# Altium schematic sheet AATB-V2.1.SchDoc
size A4; PageSetup: Record=PageOptions|CenterHorizontal=True|CenterVertical=True|PrintScale=1.00|XCorrection=1.00|YCorrection=1.00|PrintKind=0|BorderSize=5000000|LeftOffset=0|BottomOffset=0|Orientation=2|PaperLength=1000|PaperWidth=1000|Scale=100|PaperSource=15|PrintQuality=600|MediaType=1|DitherType=10|PaperKind=A3|PrintScaleMode=0
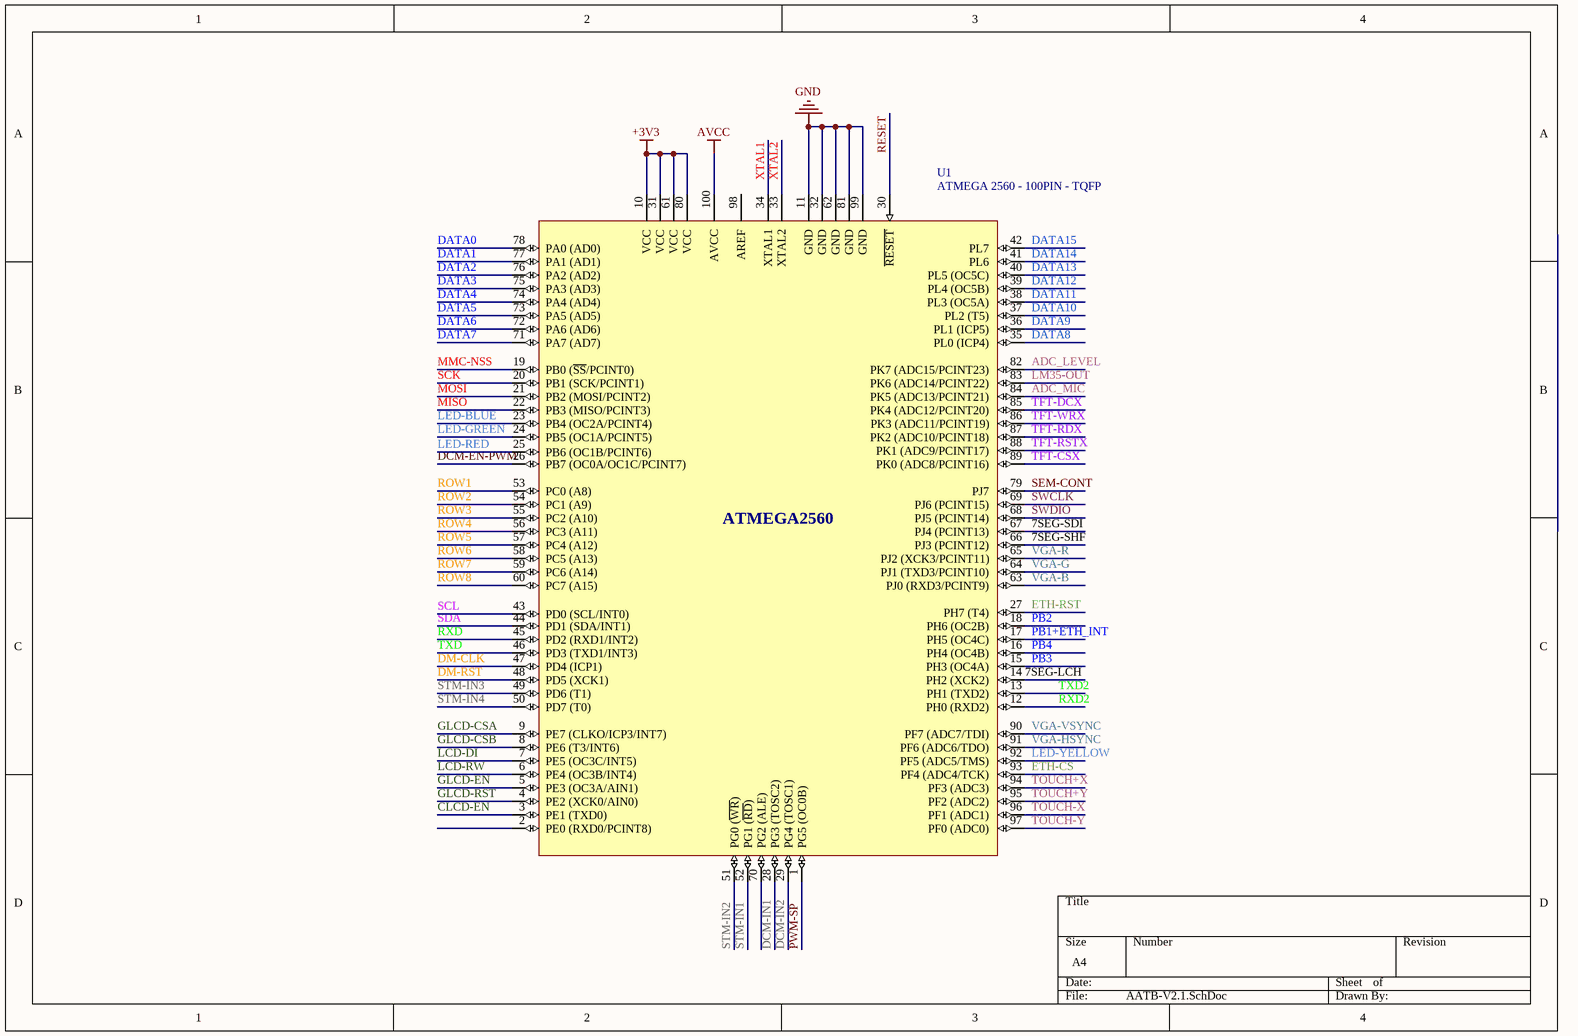
[diagram p0: AATB-V2.1.SchDoc]

## Parts
U1  ATMEGA 2560 - 100PIN - TQFP  [cpu-100-26]

## Nets
+3V3: U1.10(VCC) U1.31(VCC) U1.61(VCC) U1.80(VCC)
AVCC: U1.100(AVCC)
GND: U1.11(GND) U1.32(GND) U1.62(GND) U1.81(GND) U1.99(GND)
7SEG-LCH: U1.14(PH2_(XCK2))
7SEG-SDI: U1.67(PJ4_(PCINT13))
7SEG-SHF: U1.66(PJ3_(PCINT12))
ADC_LEVEL: U1.82(PK7_(ADC15/PCINT23))
ADC_MIC: U1.84(PK5_(ADC13/PCINT21))
CLCD-EN: U1.3(PE1_(TXD0))
DATA0: U1.78(PA0_(AD0))
DATA1: U1.77(PA1_(AD1))
DATA2: U1.76(PA2_(AD2))
DATA3: U1.75(PA3_(AD3))
DATA4: U1.74(PA4_(AD4))
DATA5: U1.73(PA5_(AD5))
DATA6: U1.72(PA6_(AD6))
DATA7: U1.71(PA7_(AD7))
DATA8: U1.35(PL0_(ICP4))
DATA9: U1.36(PL1_(ICP5))
DATA10: U1.37(PL2_(T5))
DATA11: U1.38(PL3_(OC5A))
DATA12: U1.39(PL4_(OC5B))
DATA13: U1.40(PL5_(OC5C))
DATA14: U1.41(PL6)
DATA15: U1.42(PL7)
DCM-EN-PWM: U1.26(PB7_(OC0A/OC1C/PCINT7))
DCM-IN1: U1.28(PG3_(TOSC2))
DCM-IN2: U1.29(PG4_(TOSC1))
DM-CLK: U1.47(PD4_(ICP1))
DM-RST: U1.48(PD5_(XCK1))
ETH-CS: U1.93(PF4_(ADC4/TCK))
ETH-RST: U1.27(PH7_(T4))
GLCD-CSA: U1.9(PE7_(CLKO/ICP3/INT7))
GLCD-CSB: U1.8(PE6_(T3/INT6))
GLCD-EN: U1.5(PE3_(OC3A/AIN1))
GLCD-RST: U1.4(PE2_(XCK0/AIN0))
LCD-DI: U1.7(PE5_(OC3C/INT5))
LCD-RW: U1.6(PE4_(OC3B/INT4))
LED-BLUE: U1.23(PB4_(OC2A/PCINT4))
LED-GREEN: U1.24(PB5_(OC1A/PCINT5))
LED-RED: U1.25(PB6_(OC1B/PCINT6))
LED-YELLOW: U1.92(PF5_(ADC5/TMS))
LM35-OUT: U1.83(PK6_(ADC14/PCINT22))
MISO: U1.22(PB3_(MISO/PCINT3))
MMC-NSS: U1.19(PB0_(~{SS}/PCINT0))
MOSI: U1.21(PB2_(MOSI/PCINT2))
PB1+ETH_INT: U1.17(PH5_(OC4C))
PB2: U1.18(PH6_(OC2B))
PB3: U1.15(PH3_(OC4A))
PB4: U1.16(PH4_(OC4B))
PWM-SP: U1.1(PG5_(OC0B))
RESET: U1.30(~{RESET})
ROW1: U1.53(PC0_(A8))
ROW2: U1.54(PC1_(A9))
ROW3: U1.55(PC2_(A10))
ROW4: U1.56(PC3_(A11))
ROW5: U1.57(PC4_(A12))
ROW6: U1.58(PC5_(A13))
ROW7: U1.59(PC6_(A14))
ROW8: U1.60(PC7_(A15))
RXD: U1.45(PD2_(RXD1/INT2))
RXD2: U1.12(PH0_(RXD2))
SCK: U1.20(PB1_(SCK/PCINT1))
SCL: U1.43(PD0_(SCL/INT0))
SDA: U1.44(PD1_(SDA/INT1))
SEM-CONT: U1.79(PJ7)
STM-IN1: U1.52(PG1_(~{RD}))
STM-IN2: U1.51(PG0_(~{WR}))
STM-IN3: U1.49(PD6_(T1))
STM-IN4: U1.50(PD7_(T0))
SWCLK: U1.69(PJ6_(PCINT15))
SWDIO: U1.68(PJ5_(PCINT14))
TFT-CSX: U1.89(PK0_(ADC8/PCINT16))
TFT-DCX: U1.85(PK4_(ADC12/PCINT20))
TFT-RDX: U1.87(PK2_(ADC10/PCINT18))
TFT-RSTX: U1.88(PK1_(ADC9/PCINT17))
TFT-WRX: U1.86(PK3_(ADC11/PCINT19))
TOUCH+X: U1.94(PF3_(ADC3))
TOUCH+Y: U1.95(PF2_(ADC2))
TOUCH-X: U1.96(PF1_(ADC1))
TOUCH-Y: U1.97(PF0_(ADC0))
TXD: U1.46(PD3_(TXD1/INT3))
TXD2: U1.13(PH1_(TXD2))
VGA-B: U1.63(PJ0_(RXD3/PCINT9))
VGA-G: U1.64(PJ1_(TXD3/PCINT10))
VGA-HSYNC: U1.91(PF6_(ADC6/TDO))
VGA-R: U1.65(PJ2_(XCK3/PCINT11))
VGA-VSYNC: U1.90(PF7_(ADC7/TDI))
XTAL1: U1.34(XTAL1)
XTAL2: U1.33(XTAL2)

Not connected (* = marked no-connect by the designer): U1 2(PE0_(RXD0/PCINT8)) 70(PG2_(ALE)) 98(AREF)

## Notes on the sheet
- (in symbol ATMEGA 2560) ATMEGA2560

## Library data of the parts
U1 = ATMEGA 2560